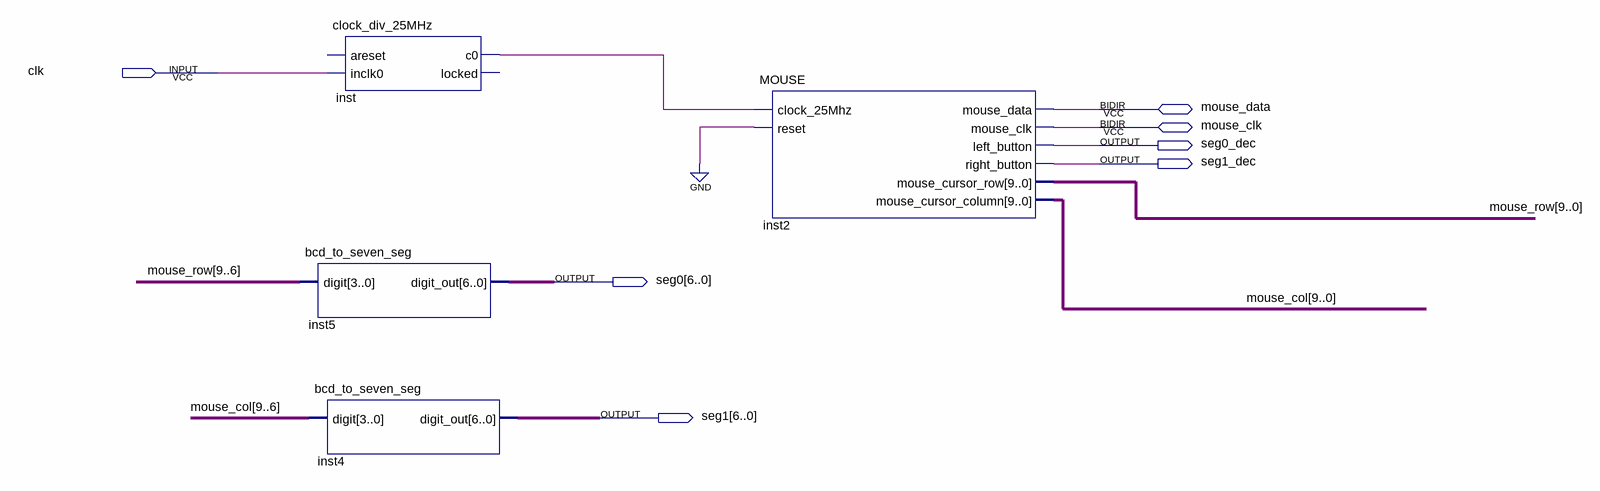
[diagram p0: schematic sheet]
// Quartus schematic Test_Mouse.bdf as structural Verilog: 4 symbols, 7 pins
module Test_Mouse (
  input  clk,
  inout  mouse_data,
  inout  mouse_clk,
  output seg0_dec,
  output seg1_dec,
  output [6:0] seg0,
  output [6:0] seg1
);

  wire inst_c0;
  wire [9:0] mouse_col, mouse_row;

  clock_div_25MHz inst (.inclk0(clk), .c0(inst_c0));  // open: areset, locked
  bcd_to_seven_seg inst5 (.digit(mouse_row[9:6]), .digit_out(seg0));
  bcd_to_seven_seg inst4 (.digit(mouse_col[9:6]), .digit_out(seg1));
  MOUSE inst2 (
    .clock_25Mhz(inst_c0), .reset(1'b0), .left_button(seg0_dec), .right_button(seg1_dec),
    .mouse_cursor_row(mouse_row), .mouse_cursor_column(mouse_col), .mouse_data(mouse_data),
    .mouse_clk(mouse_clk));
endmodule
